# EAGLE design shield_v9 (EAGLE 6.5.0)
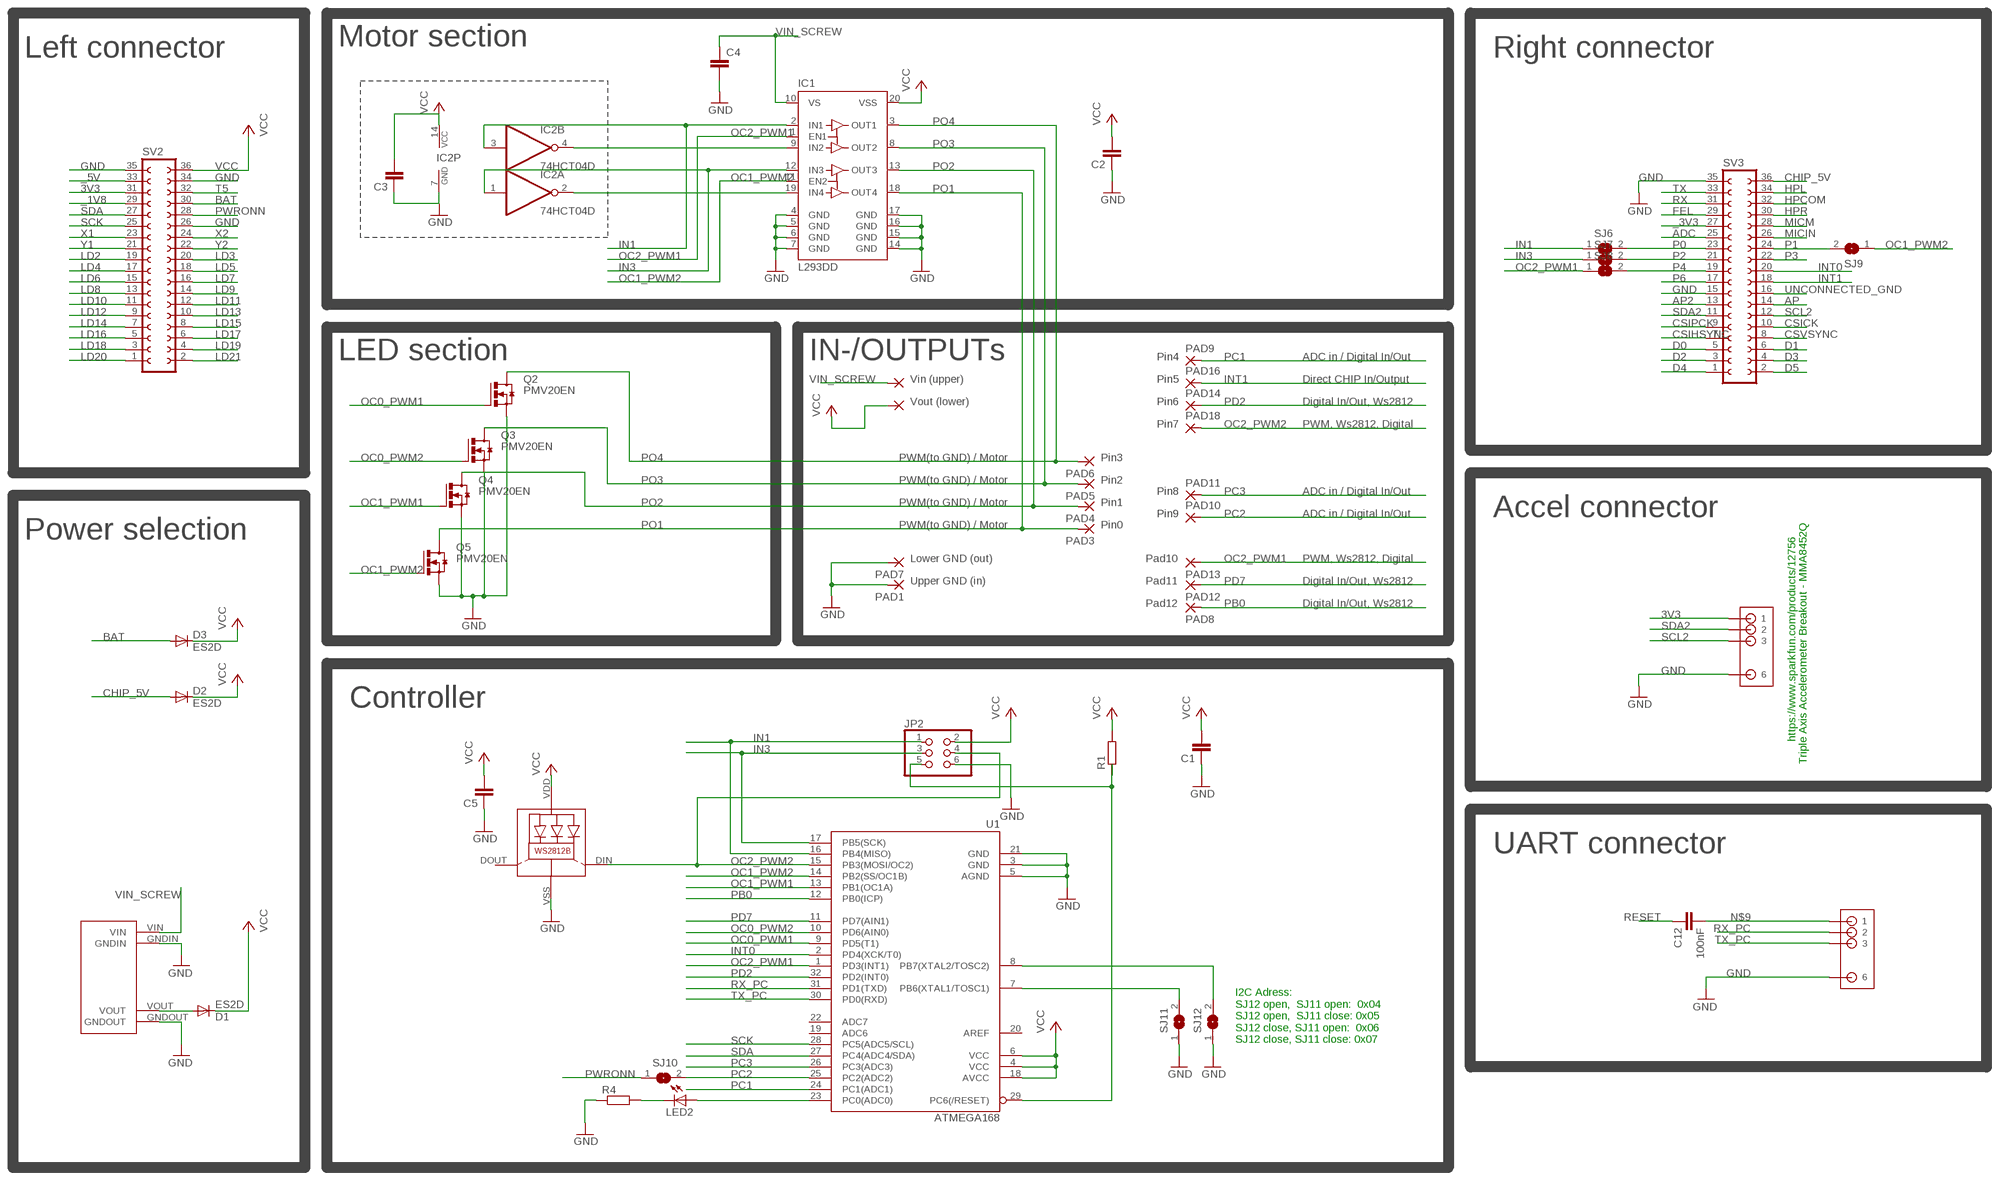
[diagram p0: schematic, sheet 1]

## Parts
C1  C-EUC0805  [C0805]
C2  C-EUC0805  [C0805]
C3  C-EUC0805  [C0805]
C4  C-EUC1210  [C1210]
C5  C-EUC0805  [C0805]
C12  100nF  C-EUC1206  [C1206]
D1  ES2D  [SMB]
D2  ES2D  [SMB]
D3  ES2D  [SMB]
IC1  L293DD  [SO20]
IC2  74HCT04D  [SO14]
JP2  PINHD-2X3  [2X03]
LED1  WS2812B  [WS2812B]
LED2  LEDCHIP-LED0805  [CHIP-LED0805]
PAD1  3,17/1,3  [3,17/1,3]
PAD2  3,17/1,3  [3,17/1,3]
PAD3  3,17/1,3  [3,17/1,3]
PAD4  3,17/1,3  [3,17/1,3]
PAD5  3,17/1,3  [3,17/1,3]
PAD6  3,17/1,3  [3,17/1,3]
PAD7  3,17/1,3  [3,17/1,3]
PAD8  WIREPADSMD1,27-254  [SMD1,27-2,54]
PAD9  3,17/1,3  [3,17/1,3]
PAD10  3,17/1,3  [3,17/1,3]
PAD11  3,17/1,3  [3,17/1,3]
PAD12  SMD2  [SMD1,27-2,54]
PAD13  SMD2  [SMD1,27-2,54]
PAD14  3,17/1,3  [3,17/1,3]
PAD16  3,17/1,3  [3,17/1,3]
PAD17  3,17/1,3  [3,17/1,3]
PAD18  3,17/1,3  [3,17/1,3]
Q2  PMV20EN  NMOSFET_SMD_223  [SOT223]
Q3  PMV20EN  NMOSFET_SMD_223  [SOT223]
Q4  PMV20EN  NMOSFET_SMD_223  [SOT223]
Q5  PMV20EN  NMOSFET_SMD_223  [SOT223]
R1  R-EU_M1206  [M1206]
R4  R-EU_M1206  [M1206]
SJ6  SJ  [SJ]
SJ7  SJ  [SJ]
SJ8  SJ  [SJ]
SJ9  SJ  [SJ]
SJ10  SJ  [SJ]
SJ11  SJ  [SJ]
SJ12  SJ  [SJ]
SV2  FE18-2  [FE18-2]
SV3  FE18-2  [FE18-2]
U1  ATMEGA168  [TQFP32-08]
U$1  MP1584EN  [MP1584EN]
U$3  6_TO_4_HEADER  [6_TO_4_HEADER]
U$4  6_TO_4_HEADER  [6_TO_4_HEADER]

## Nets
3V3: SV2.31 U$4.1
_1V8: SV2.29
_3V3: SV3.27
_5V: SV2.33
ADC: SV3.25
AP: SV3.14
AP2: SV3.13
BAT: D3.A SV2.30
CHIP_5V: D2.A SV3.36
CSICK: SV3.10
CSIHSYNC: SV3.7
CSIPCK: SV3.9
CSVSYNC: SV3.8
D0: SV3.5
D1: SV3.6
D2: SV3.3
D3: SV3.4
D4: SV3.1
D5: SV3.2
FEL: SV3.29
GND: C1.1 C2.1 C3.1 C4.2 C5.1 IC1.4(GND) IC1.5(GND) IC1.6(GND) IC1.7(GND) IC1.14(GND) IC1.15(GND) IC1.16(GND) IC1.17(GND) IC2.7(P:GND) JP2.6 LED1.VSS(GND) PAD1.1(P) PAD7.1(P) Q2.3(S) Q3.3(S) Q4.3(S) Q5.3(S) R4.1 SJ11.1 SJ12.1 SV2.26 SV2.34 SV2.35 SV3.15 SV3.35 U1.3(GND) U1.5(AGND) U1.21(GND) U$1.GNDIN U$1.GNDOUT U$3.6 U$4.6
HPCOM: SV3.32
HPL: SV3.34
HPR: SV3.30
IN1: IC1.2(IN1) IC2.3(B:I) JP2.1 SJ6.1 U1.16(PB4(MISO))
IN3: IC1.12(IN3) IC2.1(A:I) JP2.3 SJ7.1 U1.17(PB5(SCK))
INT0: SV3.20 U1.2(PD4(XCK/T0))
INT1: PAD16.1(P) SV3.18
LD2: SV2.19
LD3: SV2.20
LD4: SV2.17
LD5: SV2.18
LD6: SV2.15
LD7: SV2.16
LD8: SV2.13
LD9: SV2.14
LD10: SV2.11
LD11: SV2.12
LD12: SV2.9
LD13: SV2.10
LD14: SV2.7
LD15: SV2.8
LD16: SV2.5
LD17: SV2.6
LD18: SV2.3
LD19: SV2.4
LD20: SV2.1
LD21: SV2.2
MICIN: SV3.26
MICM: SV3.28
N$1: IC1.19(IN4) IC2.2(A:O)
N$2: SJ11.2 U1.7(PB6(XTAL1/TOSC1))
N$3: SJ12.2 U1.8(PB7(XTAL2/TOSC2))
N$7: D1.A U$1.VOUT
N$9: C12.2 U$3.1
N$11: IC1.9(IN2) IC2.4(B:O)
N$23: LED2.C R4.2
N$26: LED2.A U1.23(PC0(ADC0))
OC0_PWM1: Q2.1(G) U1.9(PD5(T1))
OC0_PWM2: Q3.1(G) U1.10(PD6(AIN0))
OC1_PWM1: Q4.1(G) U1.13(PB1(OC1A))
OC1_PWM2: IC1.11(EN2) Q5.1(G) SJ9.1 U1.14(PB2(SS/OC1B))
OC2_PWM1: IC1.1(EN1) PAD13.1(P) SJ8.1 U1.1(PD3(INT1))
OC2_PWM2: JP2.4 LED1.DIN(DI) PAD18.1(P) U1.15(PB3(MOSI/OC2))
P0: SJ6.2 SV3.23
P1: SJ9.2 SV3.24
P2: SJ7.2 SV3.21
P3: SV3.22
P4: SJ8.2 SV3.19
P6: SV3.17
PB0: PAD8.1(P) U1.12(PB0(ICP))
PC1: PAD9.1(P) U1.24(PC1(ADC1))
PC2: PAD10.1(P) SJ10.2 U1.25(PC2(ADC2))
PC3: PAD11.1(P) U1.26(PC3(ADC3))
PD2: PAD14.1(P) U1.32(PD2(INT0))
PD7: PAD12.1(P) U1.11(PD7(AIN1))
PO1: IC1.18(OUT4) PAD3.1(P) Q5.2(D) Q5.4(D)
PO2: IC1.13(OUT3) PAD4.1(P) Q4.2(D) Q4.4(D)
PO3: IC1.8(OUT2) PAD5.1(P) Q3.2(D) Q3.4(D)
PO4: IC1.3(OUT1) PAD6.1(P) Q2.2(D) Q2.4(D)
PWRONN: SJ10.1 SV2.28
RESET: C12.1 JP2.5 R1.1 U1.29(PC6(/RESET))
RX: SV3.31
RX_PC: U1.31(PD1(TXD)) U$3.2
SCK: SV2.25 U1.28(PC5(ADC5/SCL))
SCL2: SV3.12 U$4.3
SDA: SV2.27 U1.27(PC4(ADC4/SDA))
SDA2: SV3.11 U$4.2
T5: SV2.32
TX: SV3.33
TX_PC: U1.30(PD0(RXD)) U$3.3
UNCONNECTED_GND: SV3.16
VCC: C1.2 C2.2 C3.2 C5.2 D1.C D2.C D3.C IC1.20(VSS) IC2.14(P:VCC) JP2.2 LED1.VDD PAD17.1(P) R1.2 SV2.36 U1.4(VCC) U1.6(VCC) U1.18(AVCC)
VIN_SCREW: C4.1 IC1.10(VS) PAD2.1(P) U$1.VIN
X1: SV2.23
X2: SV2.24
Y1: SV2.21
Y2: SV2.22
Unconnected: IC2.5(C:I) IC2.6(C:O) IC2.8(D:O) IC2.9(D:I) IC2.10(E:O) IC2.11(E:I) IC2.12(F:O) IC2.13(F:I) LED1.DOUT(DO) U1.19(ADC6) U1.20(AREF) U1.22(ADC7)

## Notes on the sheet
- Motor section
- Left connector | Right connector
- LED section | IN-/OUTPUTs | Pin4 | ADC in / Digital In/Out
- Vin (upper) | Pin5 | Direct CHIP In/Output
- Vout (lower) | Pin6 | Digital In/Out, Ws2812
- Pin7 | PWM, Ws2812, Digital
- PWM(to GND) / Motor | Pin3
- PWM(to GND) / Motor | Pin2
- Pin8 | ADC in / Digital In/Out
- PWM(to GND) / Motor | Pin1
- Pin9 | ADC in / Digital In/Out | Accel connector
- PWM(to GND) / Motor | Pin0
- Power selection
- Lower GND (out) | Pad10 | PWM, Ws2812, Digital
- Upper GND (in) | Pad11 | Digital In/Out, Ws2812
- Pad12 | Digital In/Out, Ws2812
- Controller
- https://www.sparkfun.com/products/12756
- Triple Axis Accelerometer Breakout - MMA8452Q
- UART connector
- I2C Adress: 
  SJ12 open,  SJ11 open:  0x04
  SJ12 open,  SJ11 close: 0x05
  SJ12 close, SJ11 open:  0x06
  SJ12 close, SJ11 close: 0x07

## Library data of the parts
C1-C5 C12 = rcl:C-EU: CAPACITOR, European symbol
D1-D3 = diode:ES2D: DIODE super fast rectifier, 2 A
IC1 = st-microelectronics:L293DD: PUSH-PULL FOUR CHANNEL DRIVER WITH DIODES Source: http://www.st.com/stonline/books/pdf/docs/1330.pdf; OC_FARNELL: unknown
IC2 = 74xx-eu:74*04: Hex INVERTER
JP2 = pinhead:PINHD-2X3: PIN HEADER
LED1 = WS2812B:WS2812B: Features and Benefits  * Intelligent reverse connect protection, the power supply reverse connection does not damage the IC. * The control circuit and the LED share the only power source. Control circuit and RGB chip are integrated in a package of 5050 components, form a complete control of pixel point.  * Built-in signal reshaping circuit, after wave reshaping to the next driver, ensure wave-form distortion not accumulate.  * Built-in electric reset circuit and power lost reset circuit.  * Each pixel of the three primary color can achieve 256 brightness display, completed 16777216 color full color display, and scan frequency not less than 400Hz/s.  * Cascading port transmission signal by single line.  * Any two point the distance more than 5m transmission signal without any increase circuit.  * When the refresh rate is 30fps, cascade number are not less than1024 points.  * Send data at speeds of 800Kbps.  *The color of the light were highly consistent, cost-effective. Applications  Full-color module, Full color soft lights a lamp strip. LED decorative lighting, Indoor/outdoor LED video irregular screen. General description WS2812B is a intelligent control LED light source that the control circuit and RGB chip are integrated in a package of 5050 components. It internal include intelligent digital port data latch and signal reshaping amplification drive circuit. Also include a precision internal oscillator and a 12V voltage programmable constant curre-nt control part, effectively ensuring the pixel point light color height consistent. The data transfer protocol use single NZR communication mode. After the pixel power-on reset, the DIN port receive data from controller, the first pixel collect initial 24bit data then sent to the internal data latch, the other data which reshaping by the internal signal reshaping amplification circuit sent to the next cascade pixel through the DO port. After transmission for each pixel,the signal to reduce 24bit. pixel adopt auto reshaping transmit technology, making the pixel cascade number is not limited the signal transmission, only depend on the speed of signal transmission. LED with low driving voltage, environmental protection and energy saving, high brightness, scattering angle is large, good consistency, low power, long life and other advantages. The control chip integrated in LED above becoming more simple circuit, small volume, convenient installation. Absolute Maximum Ratings Power supply voltage: VDD +3.5V..+5.3V Input voltage: VI -0.5V..VDD+0.5V based on WS2812 from https://github.com/adafruit/Adafruit-Eagle-Library
LED2 = led:LED: LED OSRAM: - CHIPLED LG R971, LG N971, LY N971, LG Q971, LY Q971, LO R971, LY R971 LH N974, LH R974 LS Q976, LO Q976, LY Q976 LO Q996 - Hyper CHIPLED LW Q18S LB Q993, LB Q99A, LB R99A - SideLED LS A670, LO A670, LY A670, LG A670, LP A670 LB A673, LV A673, LT A673, LW A673 LH A674 LY A675 LS A676, LA A676, LO A676, LY A676, LW A676 LS A679, LY A679, LG A679 - Hyper Micro SIDELED® LS Y876, LA Y876, LO Y876, LY Y876 LT Y87S - SmartLED LW L88C, LW L88S LB L89C, LB L89S, LG L890 LS L89K, LO L89K, LY L89K LS L896, LA L896, LO L896, LY L896 - TOPLED LS T670, LO T670, LY T670, LG T670, LP T670 LSG T670, LSP T670, LSY T670, LOP T670, LYG T670 LG T671, LOG T671, LSG T671 LB T673, LV T673, LT T673, LW T673 LH T674 LS T676, LA T676, LO T676, LY T676, LB T676, LH T676, LSB T676, LW T676 LB T67C, LV T67C, LT T67C, LS T67K, LO T67K, LY T67K, LW E67C LS E67B, LA E67B, LO E67B, LY E67B, LB E67C, LV E67C, LT E67C LW T67C LS T679, LY T679, LG T679 LS T770, LO T770, LY T770, LG T770, LP T770 LB T773, LV T773, LT T773, LW T773 LH T774 LS E675, LA E675, LY E675, LS T675 LS T776, LA T776, LO T776, LY T776, LB T776 LHGB T686 LT T68C, LB T68C - Hyper Mini TOPLED® LB M676 - Mini TOPLED Santana® LG M470 LS M47K, LO M47K, LY M47K Source: http://www.osram.convergy.de LUXEON: - LUMILED® LXK2-PW12-R00, LXK2-PW12-S00, LXK2-PW14-U00, LXK2-PW14-V00 LXK2-PM12-R00, LXK2-PM12-S00, LXK2-PM14-U00 LXK2-PE12-Q00, LXK2-PE12-R00, LXK2-PE12-S00, LXK2-PE14-T00, LXK2-PE14-U00 LXK2-PB12-K00, LXK2-PB12-L00, LXK2-PB12-M00, LXK2-PB14-N00, LXK2-PB14-P00, LXK2-PB14-Q00 LXK2-PR12-L00, LXK2-PR12-M00, LXK2-PR14-Q00, LXK2-PR14-R00 LXK2-PD12-Q00, LXK2-PD12-R00, LXK2-PD12-S00 LXK2-PH12-R00, LXK2-PH12-S00 LXK2-PL12-P00, LXK2-PL12-Q00, LXK2-PL12-R00 Source: www.luxeon.com KINGBRIGHT: KA-3528ASYC Source: www.kingbright.com
PAD1-PAD7 PAD9-PAD11 PAD14 PAD16-PAD18 = wirepad:3,17/1,3: THROUGH-HOLE PAD
PAD8 = wirepad:WIREPAD: Wire PAD connect wire on PCB
PAD12 PAD13 = wirepad:SMD2: SMD PAD
Q2-Q5 = transistor-power:NMOSFET_SMD_223
R1 R4 = rcl:R-EU_: RESISTOR, European symbol
SJ6-SJ12 = jumper:SJ: SMD solder JUMPER
SV2 SV3 = con-lsta:FE18-2: FEMALE HEADER; OC_FARNELL: unknown; OC_NEWARK: unknown
U1 = SparkFun-DigitalIC:ATMEGA168: Atmel 32-pin 8-bit micro, 16k flash.
U$1 = power_supply:MP1584EN
U$3 U$4 = power_supply:6_TO_4_HEADER

## Board
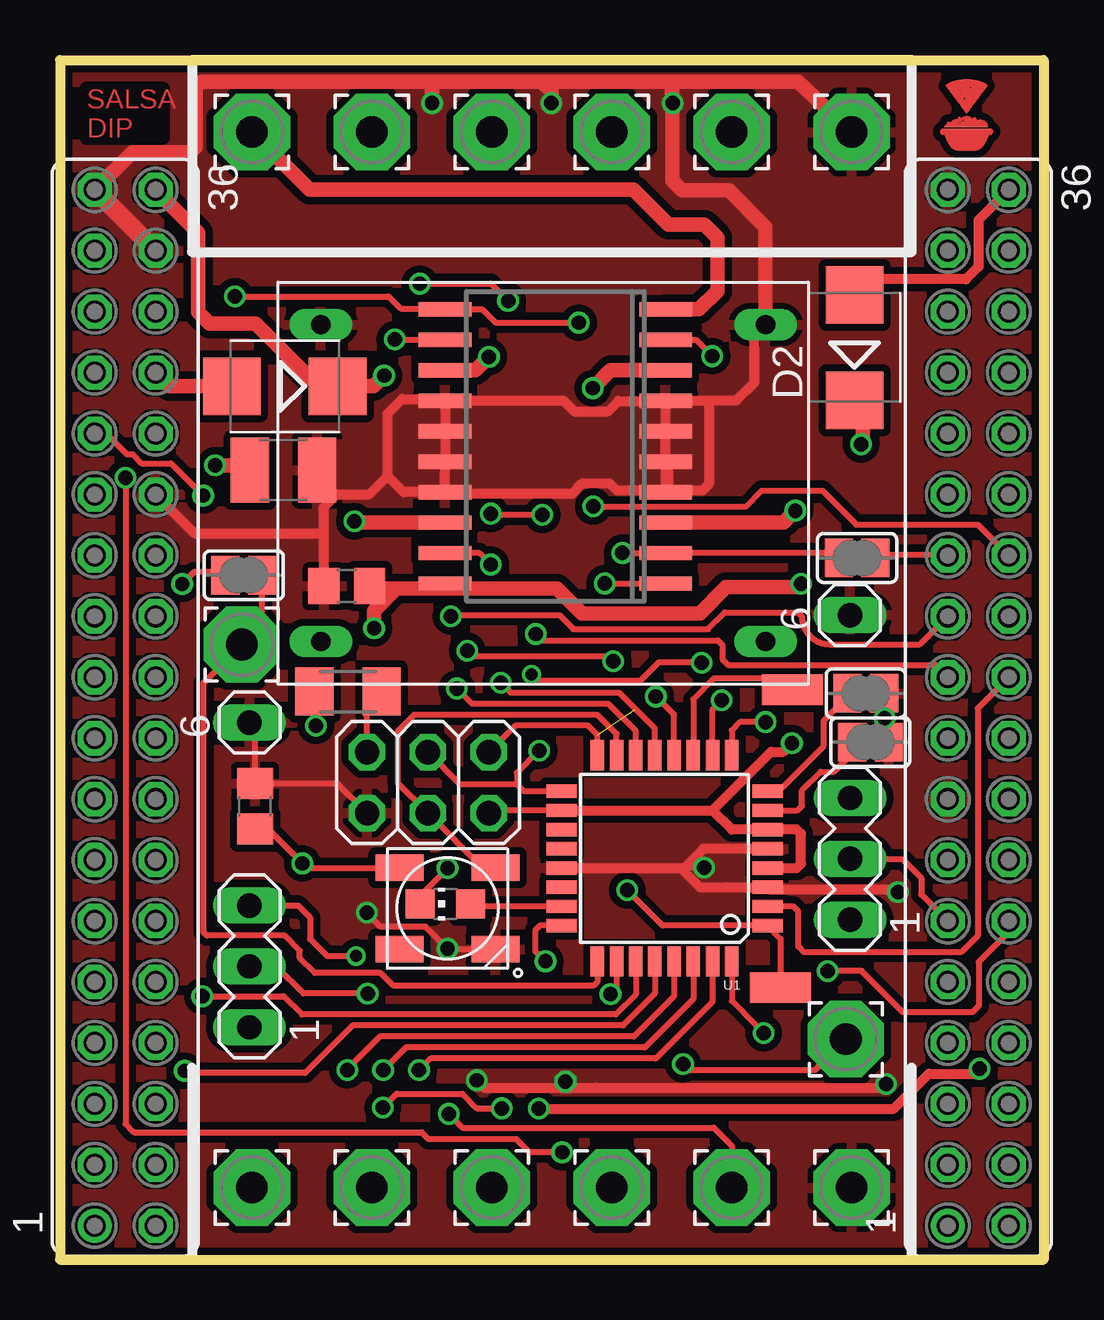
[diagram p1: board, top side]
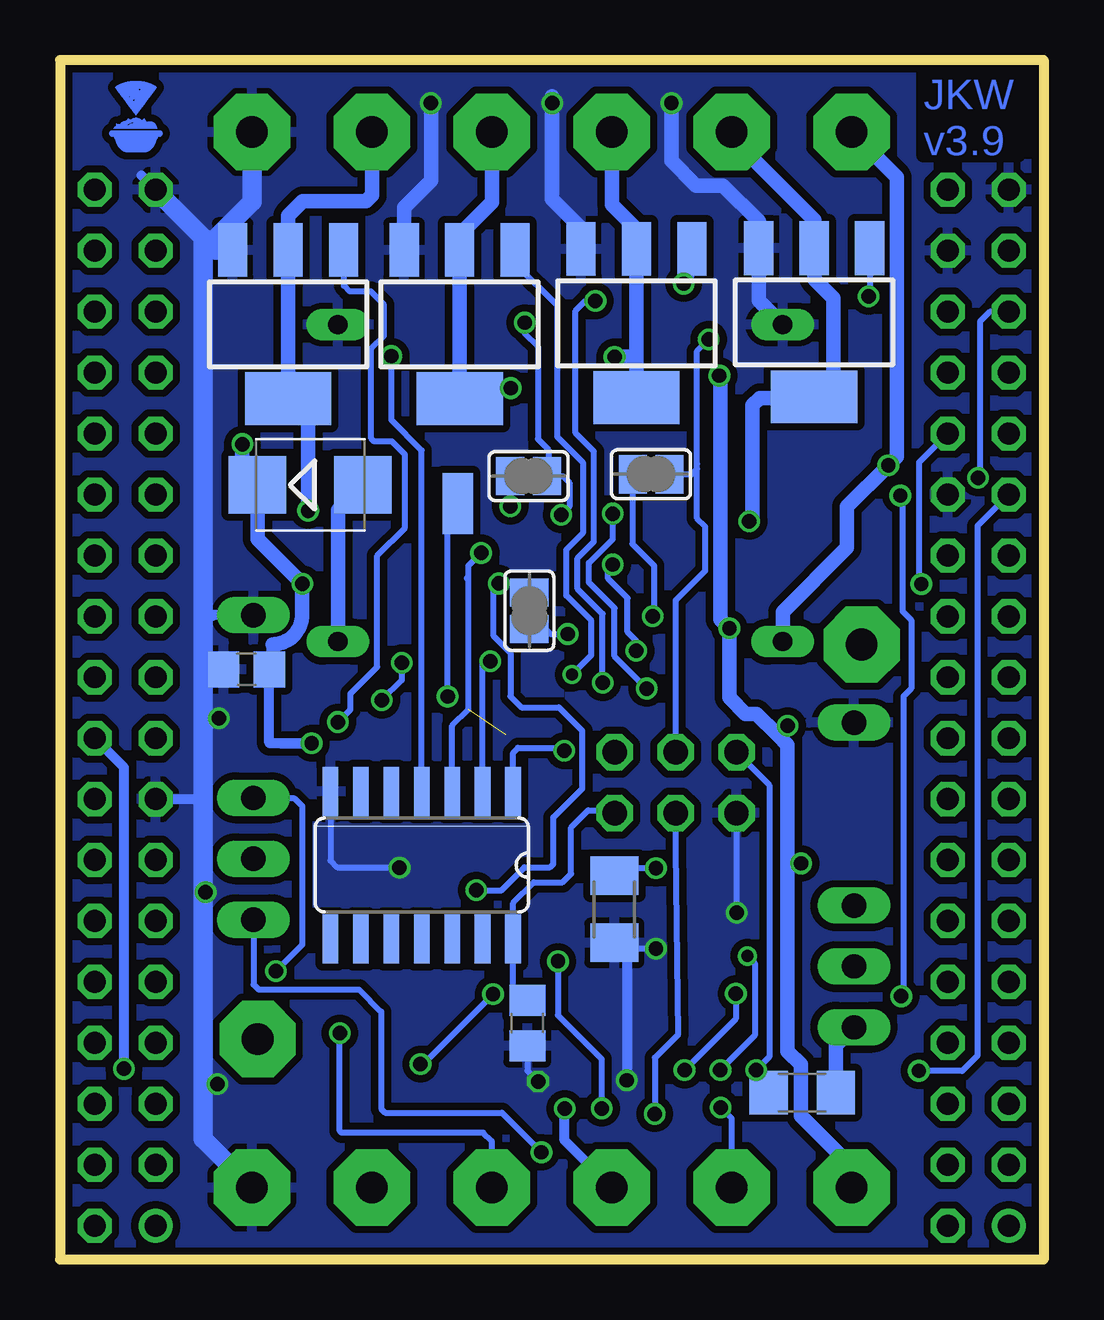
[diagram p2: board, bottom side, seen from below]

Size 41 x 50 mm. Coordinates in mm from the lower left corner, seen from the top.
Outline: 0,50 41,50 41,0 0,0 0,50
Copper layers (1*16): Top 0.035mm / dielectric 1.5mm / Bottom 0.035mm
Design rules "SeeedStudio_2layer_DRU_no_angle_20140221": minimum track width 6mil, minimum drill 12mil, track to track 6mil, track to pad 6mil, pad to pad 6mil, via to via 6mil, smd to smd 0mil, copper to edge 10mil, drill to drill 10mil, minimum pad ring 10mil, minimum via ring 6mil, stop-mask expansion 2mil, vias tented up to drill 100mil, thermal gap 10mil

### Footprints (pad centres in the part's own frame; a part is rotated, then mirrored left to right if it is on the bottom)
C0805 = smd 1.3 x 1.5: 1 -0.95,0; 2 0.95,0
C1210 = smd 1.6 x 2.7: 1 -1.4,0; 2 1.4,0
C1206 = smd 1.6 x 1.8: 1 -1.4,0; 2 1.4,0
SMB = smd 2.4 x 2.4: A 2.2,0; C -2.2,0
SO20 = smd 0.6 x 2.2: 1 -5.715,-4.6; 2 -4.445,-4.6; 3 -3.175,-4.6; 4 -1.905,-4.6; 5 -0.635,-4.6; 6 0.635,-4.6; 7 1.905,-4.6; 8 3.175,-4.6; 9 4.445,-4.6; 10 5.715,-4.6; 11 5.715,4.6; 12 4.445,4.6; 13 3.175,4.6; 14 1.905,4.6; 15 0.635,4.6; 16 -0.635,4.6; 17 -1.905,4.6; 18 -3.175,4.6; 19 -4.445,4.6; 20 -5.715,4.6
SO14 = smd 0.66 x 2.032: 1 -3.81,-3.073; 2 -2.54,-3.073; 3 -1.27,-3.073; 4 0,-3.073; 5 1.27,-3.073; 6 2.54,-3.073; 7 3.81,-3.073; 8 3.81,3.073; 9 2.54,3.073; 10 1.27,3.073; 11 0,3.073; 12 -1.27,3.073; 13 -2.54,3.073; 14 -3.81,3.073
2X03 = drill 1.016 octagon: 1 -2.54,-1.27; 2 -2.54,1.27; 3 0,-1.27; 4 0,1.27; 5 2.54,-1.27; 6 2.54,1.27
WS2812B = smd 2 x 1.1: DIN 2,1.7; DOUT -2,-1.7; VDD -2,1.7; VSS 2,-1.7
CHIP-LED0805 = smd 1.2 x 1.2: A 0,-1.05; C 0,1.05
3,17/1,3 = drill 1.321 pad 3.175 octagon: 1 0,0
SMD1,27-2,54 = smd 1.27 x 2.54: 1 0,0
SOT223 = smd 1.219 x 2.235: 1 -2.311,-3.099; 2 0,-3.099; 3 2.311,-3.099 | smd 3.6 x 2.2: 4 0,3.099
M1206 = smd 1.6 x 2: 1 -1.4,0; 2 1.4,0
SJ = smd 1.168 x 1.6: 1 -0.762,0; 2 0.762,0
FE18-2 = drill 0.914: 1 -21.59,1.27 | drill 0.914 octagon: 2 -21.59,-1.27; 3 -19.05,1.27; 4 -19.05,-1.27; 5 -16.51,1.27; 6 -16.51,-1.27; 7 -13.97,1.27; 8 -13.97,-1.27; 9 -11.43,1.27; 10 -11.43,-1.27; 11 -8.89,1.27; 12 -8.89,-1.27; 13 -6.35,1.27; 14 -6.35,-1.27; 15 -3.81,1.27; 16 -3.81,-1.27; 17 -1.27,1.27; 18 -1.27,-1.27; 19 1.27,1.27; 20 1.27,-1.27; 21 3.81,1.27; 22 3.81,-1.27; 23 6.35,1.27; 24 6.35,-1.27; 25 8.89,1.27; 26 8.89,-1.27; 27 11.43,1.27; 28 11.43,-1.27; 29 13.97,1.27; 30 13.97,-1.27; 31 16.51,1.27; 32 16.51,-1.27; 33 19.05,1.27; 34 19.05,-1.27; 35 21.59,1.27; 36 21.59,-1.27
TQFP32-08 = smd 1.27 x 0.559: 1 -4.293,2.8; 2 -4.293,2; 3 -4.293,1.2; 4 -4.293,0.4; 5 -4.293,-0.4; 6 -4.293,-1.2; 7 -4.293,-2; 8 -4.293,-2.8; 17 4.293,-2.8; 18 4.293,-2; 19 4.293,-1.2; 20 4.293,-0.4; 21 4.293,0.4; 22 4.293,1.2; 23 4.293,2; 24 4.293,2.8 | smd 0.559 x 1.27: 9 -2.8,-4.293; 10 -2,-4.293; 11 -1.2,-4.293; 12 -0.4,-4.293; 13 0.4,-4.293; 14 1.2,-4.293; 15 2,-4.293; 16 2.8,-4.293; 25 2.8,4.293; 26 2,4.293; 27 1.2,4.293; 28 0.4,4.293; 29 -0.4,4.293; 30 -1.2,4.293; 31 -2,4.293; 32 -2.8,4.293
MP1584EN = drill 0.8 long: GNDIN 1.778,14.986; GNDOUT 20.32,14.986; VIN 1.778,1.778; VOUT 20.32,1.778
6_TO_4_HEADER = drill 1.016 long: 1 0,-6.35; 2 0,-3.81; 3 0,-1.27; 6 0,6.35

### Placement (x,y rotation side)
C1  33.22,24.6 0 bottom
C2  11.95,28.07 0 top
C3  21.52,9.85 90 bottom
C4  9.32,32.91 0 top
C5  8.13,18.9 270 top
C12  10.06,6.96 0 bottom
D1  30.57,32.28 0 bottom
D2  33.12,38.01 90 top
D3  9.37,36.4 180 top
IC1  20.65,33.89 90 top
IC2  25.92,16.44 180 bottom
JP2  15.34,19.88 180 top
LED1  16.15,14.63 0 top
LED2  16.06,14.82 90 top
PAD1  33,47 0 top
PAD2  8,47 0 top
PAD3  13,47 0 top
PAD4  18,47 0 top
PAD5  23,47 0 top
PAD6  28,47 0 top
PAD7  33,3 0 top
PAD8  24.42,31.5 180 bottom
PAD9  13,3 0 top
PAD10  7.58,25.63 0 top
PAD11  32.76,9.18 0 top
PAD12  30.52,23.76 270 top
PAD13  30.04,11.33 90 top
PAD14  23,3 0 top
PAD16  18,3 0 top
PAD17  8,3 0 top
PAD18  28,3 0 top
Q2  31.49,38.98 180 bottom
Q3  24.34,38.98 180 bottom
Q4  16.97,39.02 180 bottom
Q5  9.56,39.06 180 bottom
R1  12.01,23.67 180 top
R4  17.89,14.6 90 bottom
SJ6  33.23,29.24 0 top
SJ7  16.36,32.74 180 bottom
SJ8  21.43,27.05 270 bottom
SJ9  21.47,32.66 180 bottom
SJ10  7.66,28.52 0 top
SJ11  33.78,21.56 180 top
SJ12  33.59,23.6 180 top
SV2  2.72,23 90 top
SV3  38.28,23 90 top
U1  25.2,16.72 180 top
U$1  9.09,23.98 0 top
U$2  LOGO  [LOGO]  36.54,46.02 0 top
U$3  7.9,16.03 0 top
U$4  32.93,20.51 0 top
U$5  LOGO  [LOGO]  39.09,46.1 0 bottom

### Tracks (layer width: path | path; a pad name or v marks a point on that pad's centre or on a via)
3V3  (via drill 0.6)
  Top 0.254: v2.73,32.59 2.73,5.65 3.07,5.31 15.07,5.31 15.37,5.02 19.02,5.02 19.57,4.47 v20.93,4.47
  Bottom 0.254: U$4.1 32.93,11.47 32.72,11.25 28.54,11.25 27.61,10.32 27.61,6.29 27.45,6.12 22.58,6.12 v20.93,4.47 | SV2.31 2.23,39.51 2.65,39.09 2.65,32.66 v2.73,32.59
BAT
  Top 0.61: SV2.30 4.56,36.4 D3.A
CHIP_5V
  Top 0.406: SV3.36 38.29,43.33 38.29,41.38 37.77,40.86 34.13,40.86 D2.A
GND  (via drill 0.6)
  Top 0.254: 34.29,7.16 v34.44,7.32 | LED1.VSS 16.48,12.93 v16.15,12.95 15.24,13.87 13.37,13.87 v12.79,14.45 | 22.38,7.18 22.36,7.16 | U$3.6 8.13,22.15 C5.1 11.56,19.85 JP2.6 | v26.85,16.33 26.18,16.33 26.11,16.4 | 34.35,21.75 SJ11.1 34.38,21.73 v34.38,22.57 34.35,22.59 SJ12.1
  Top 0.406: U1.21 25.87,16.32 25.95,16.24 | 29.45,17.08 U1.5 26.82,17.12 26.11,16.4 25.95,16.24 | 27.77,15.52 U1.3 | v17.37,7.47 17.68,7.16 22.36,7.16 34.29,7.16 | 25.95,16.24 26.67,15.52 U1.3 | IC1.7 23.28,35.79 22.84,35.34 21.45,35.34 21,35.8 IC1.14 IC1.15 | IC1.7 27.03,35.8 27.05,35.81 | 27.05,35.81 27.05,32.32 26.78,32.05 25.32,32.05 | 25.32,32.05 IC1.4 | 25.32,32.05 23.22,32.05 22.94,32.33 21.77,32.33 21.35,31.91 16.12,31.91 IC1.17 | IC1.17 14.33,31.99 13.65,32.66 | 13.65,32.66 13.65,35.26 14.26,35.87 16,35.87 16.03,35.84 | 27.05,35.81 28.21,35.81 28.94,36.55 28.94,38.49 U$1.GNDOUT | IC1.17 IC1.16 | IC1.15 16.05,33.28 16.07,33.26 16.07,34.51 IC1.15 | IC1.7 25.24,32.09 25.38,31.95 25.38,33.13 IC1.5 IC1.6 | 13.65,32.66 12.88,31.89 11.53,31.89 11,31.36 11,30.26 | C2.1 11,30.26 | SV2.26 5.62,30.26 11,30.26 | U1.3 29.58,15.43 34.81,15.43 v34.93,15.31 | SJ11.1 34.51,21.6
  Top 0.61: 15.51,49.1 20.08,49.1 | 20.08,49.1 25.51,49.1 | 25.51,49.1 30.77,49.1 PAD1.1 | 25.51,49.1 25.51,48.52 v25.54,48.2 25.54,44.96 25.93,44.56 27.89,44.56 29.41,43.04 U$1.GNDOUT | v15.51,48.2 15.51,49.1 | v20.48,48.2 20.48,48.7 20.08,49.1 | 15.51,49.1 5.92,49.1 5.66,48.84 5.66,46.35 5.47,46.16 3.02,46.16 SV2.35
  Top 0.813: SV2.35 SV2.34
  Bottom 0.254: 17.37,12.68 R4.1 17.65,12.95 v16.15,12.95 | C3.1 21.52,7.87 v21.07,7.42 | JP2.6 12.8,14.46 v12.79,14.45 | 34.63,26.84 35.04,27.24 | IC2.7 29.73,16.63 29.44,16.34 26.86,16.34 v26.85,16.33 | C1.1 34.26,24.69 35.04,24.69 | 32.63,47.37 PAD1.1
  Bottom 0.406: SV3.15 35.11,19.19 35.04,19.12 | 35.05,15.41 35.04,15.42 | 35.04,15.2 v34.93,15.31 34.93,15.71 35.04,15.82 | 35,21.45 35.04,21.41 | 34.92,21.43 34.9,21.45 35.04,21.59 35.04,21.61 | 34.89,26.55 35.04,26.4 | 17.37,12.68 v17.37,7.47 | v34.44,7.32 35.04,7.32 | 37.61,45.19 SV3.35 | 34.84,38.95 35.04,38.75 | v34.38,22.57 34.56,22.49 35.04,22.02 | U$4.6 34.61,26.86 34.63,26.84
  Bottom 0.61: Q3.3 26.65,43.85 25.54,44.96 v25.54,48.2 | v20.48,48.2 20.49,48.48 20.49,44.2 19.28,42.99 Q4.3 | v15.51,48.2 15.51,45.8 14.48,44.77 13.36,44.77 11.87,43.28 Q5.3 11.87,39.96 U$1.GNDIN
  Bottom 0.813: 35.04,42.6 35.04,38.75 35.04,27.24 35.04,26.4 35.04,24.69 35.04,22.02 35.04,21.61 35.04,21.41 35.04,19.12 35.04,15.82 35.04,15.42 35.04,15.2 35.04,7.32 35.04,5.04 PAD7.1 | Q2.3 34.52,42.08 34.76,42.33 | 34.76,42.33 35.04,42.6 | PAD1.1 33,44.09 34.76,42.33 | SV3.35 37.01,44.57 35.04,42.6
  pour Top (isolate 0.305, rank 2): -0.07,0.25 40.88,0.25 41.01,10.57 41.01,50.01 0,50.01 0,10.47
  pour Bottom (isolate 0.305): 0,50 41.05,50 41.05,0.25 0.02,0.25 0.02,49.92
  pour Top (isolate 0.305, no thermals): 12.24,34.04 14.05,35.84 20.97,35.9 21.42,35.45 22.83,35.45 23.2,35.81 28.13,35.81 28.24,35.7 28.24,32.35 27.85,31.95 23.33,31.95 23.05,32.23 21.77,32.23 21.4,31.86 11.16,31.85 10.36,32.65 10.26,34.09
IN1  (via drill 0.6)  (1 unrouted)
  Top 0.254: JP2.1 18.98,22.25 22.02,22.25 22.4,21.87 U1.16 | v23.44,29.45 IC1.2 32.26,29.45 SJ6.1
  Bottom 0.254: IC2.3 24.65,22.25 23.98,22.92 23.98,28.46 | 23.98,28.46 23.98,28.92 v23.44,29.45 | 24.04,28.4 23.98,28.46
IN3  (via drill 0.6)
  Top 0.254: U1.17 19.34,19.52 19.05,19.81 | 19.05,19.81 16.68,19.81 JP2.3 | v19.98,21.21 19.05,20.28 19.05,19.81 | v13.96,38.35 16.03,38.35 IC1.12
  Bottom 0.254: JP2.3 15.34,27.47 14.1,28.71 14.1,30.54 14.44,30.89 14.44,32.96 | IC2.1 22.11,21.12 21.91,21.32 20.09,21.32 v19.98,21.21 | 14.22,38.09 v13.96,38.35 14.44,37.87 14.44,33.16 14.44,32.96 | SJ7.1 14.66,32.73 14.44,32.96
INT0
  Top 0.254: SV3.20 38.25,22.97 38.25,13.49 37.59,12.83 30.99,12.83 30.77,13.04 30.77,14.52 30.57,14.72 U1.2
INT1  (via drill 0.6)
  Top 0.406: v19.96,6.29 34.76,6.29 36.22,7.75 38.13,7.75 v38.33,7.95
  Bottom 0.406: PAD16.1 19.96,4.96 v19.96,6.29 | v38.33,7.95 38.33,20.51 SV3.18
N$1  (via drill 0.6)
  Top 0.254: 17.21,25.15 v16.98,25.38 17.22,25.13 22.87,25.13 v23.06,24.94 | v17.96,28.97 17.48,29.45 IC1.19
  Bottom 0.254: IC2.2 23.38,24.83 23.27,24.94 v23.06,24.94 | v16.98,25.38 16.98,25.79 17.34,26.15 17.34,27.57 18.15,28.38 18.15,28.78 v17.96,28.97
N$2
  Top 0.254: U1.7 30.75,18.72 30.94,18.91 30.94,19.56 31.71,20.33 32.27,20.33 33.03,21.09 33.03,21.78 33.03,22.12
  Top 0.406: SJ11.2 33.03,21.58 33.03,21.78
N$3
  Top 0.254: U1.8 29.95,19.52 31.84,21.41 31.84,22.47 32.83,23.46 SJ12.2
N$7
  Bottom 0.61: U$1.VOUT 29.41,31.24 D1.A
N$9
  Bottom 0.406: 7.9,9.61 U$3.1
  Bottom 0.61: C12.2 8.66,8.92 U$3.1
N$11  (via drill 0.6)
  Top 0.254: IC1.9 26.51,38.34 v27.19,37.66
  Bottom 0.254: IC2.4 25.92,33.73 27.19,35 v27.19,37.66
N$23  (via drill 0.6)
  Top 0.254: LED2.C 15.01,15.16 v16.15,16.31
  Bottom 0.254: v16.15,16.31 17.59,16.31 arc-90 R4.2
N$26
  Top 0.254: U1.23 17.21,14.72
  Top 0.406: 17.21,14.72 LED2.A
OC0_PWM1  (via drill 0.6)
  Top 0.254: v29.41,22.4 28.35,22.4 28,22.06 U1.9
  Bottom 0.254: v29.41,22.4 28.89,22.93 28.89,23.59 27.77,24.7 27.77,29.34 26.62,30.49 26.62,33.55 27.16,34.1 27.9,34.1 28.03,34.23 28.03,37.96 27.5,38.49 27.5,39.8 28.04,40.35 28.92,40.35 29.16,40.59 29.16,41.4 29.18,41.42 | 29.13,42.03 Q2.1
  Bottom 0.406: 29.18,41.42 Q2.1
OC0_PWM2  (via drill 0.5, 0.6)
  Top 0.254: U1.10 27.2,22.93 v27.58,23.32 | v19.66,24.38 19.91,24.13 24.19,24.13 24.94,24.88 v26.75,24.88
  Bottom 0.254: 22.1,42.01 Q3.1 22.03,41.51 20.27,39.75 20.27,34.29 19.2,33.22 19.2,30.28 19.89,29.59 19.89,27.67 18.85,26.63 18.85,25.2 v19.66,24.38 | v27.58,23.32 26.75,24.16 v26.75,24.88
  Bottom 0.406: Q3.1 22.06,42.05
OC1_PWM1  (via drill 0.6)
  Top 0.254: U1.13 24.8,22.14 23.32,23.62 18.8,23.62 v18.38,24.04 | v15,40.68 17.96,40.68 v18.68,39.96
  Bottom 0.254: v18.68,39.96 19.09,39.96 19.51,39.54 19.51,34.44 18.75,33.68 18.75,29.92 19.42,29.25 19.42,27.95 18.38,26.91 v18.38,24.04 | Q4.1 14.66,41.02 v15,40.68
OC1_PWM2  (via drill 0.6)
  Top 0.254: U1.14 24,22.02 22.86,23.16 17.18,23.16 v16.54,23.8 | v7.29,40.15 13.69,40.15 14.2,39.64 16.02,39.64 IC1.11 17.59,39.61 18.15,39.05 v21.63,39.05 | v20.1,31.04 18.01,31.04 v17.96,31.09
  Bottom 0.254: v16.54,23.8 17.88,25.14 17.88,27.15 18.95,28.22 18.95,29.03 17.96,30.02 v17.96,31.09 17.88,31.01 | Q5.1 7.25,40.19 v7.29,40.15 | v21.63,39.05 21.63,38.59 21.08,38.05 21.08,34.2 20.64,33.76 20.64,32.72 SJ9.1 20.03,32.66 19.76,32.38 19.76,31.38 v20.1,31.04
  Bottom 0.406: 7.25,42.99 Q5.1
OC2_PWM1  (via drill 0.6)
  Top 0.254: v22.71,28.18 IC1.1 | PAD13.1 30.04,13.37 U1.1 25.12,13.92 v23.65,15.39
  Bottom 0.254: SJ8.1 21.2,28.18 v22.71,28.18 22.92,27.96 22.92,25.98 22.23,25.29 22.23,23.47 21.77,23.01 20.21,23.01 19.23,22.04 19.23,19.63 20.43,18.43 20.43,16.48 20.57,16.34 21.64,16.34 22.59,15.39 v23.65,15.39
OC2_PWM2  (via drill 0.6)
  Top 0.254: PAD18.1 28,4.75 27.25,5.5 16.78,5.5 v16.2,6.07 | U1.15 23.2,21.91 22.4,22.71 14.77,22.71 14.08,22.02 14.08,19.87 JP2.4 17.62,16.33 LED1.DIN
  Bottom 0.254: JP2.4 15.22,9.39 16.2,8.41 16.2,6.34 v16.2,6.07
P0
  Top 0.254: SJ6.2 34.12,29.38 36.98,29.38
  Top 0.406: 36.98,29.38 SV3.23
P1  (via drill 0.6)
  Top 0.254: SV3.24 38.27,30.63 33.2,30.63 31.79,32.04 29.25,32.04 28.6,31.39 v22.23,31.39
  Bottom 0.254: v22.23,31.39 SJ9.2
P2  (via drill 0.6)
  Top 0.254: SV3.21 35.84,25.64 32.09,25.64 arc-90 30.92,26.81 30.76,26.98 27.71,26.98 27.01,26.28 21.4,26.28 20.82,26.86 16.34,26.86 v16.29,26.81
  Bottom 0.254: 17.16,32.7 17.14,32.71 | 17.14,32.71 SJ7.2 | 17.14,32.71 17.14,29.83 16.23,28.92 16.23,26.87 v16.29,26.81
P4  (via drill 0.6)
  Top 0.254: SV3.19 36.49,24.79 27.84,24.79 27.64,24.99 27.64,25.59 27.42,25.81 20.1,25.81 v19.84,26.07
  Bottom 0.254: SJ8.2 21.34,26.38 20.87,26.38 20.56,26.07 v19.84,26.07
PB0  (via drill 0.6)
  Top 0.254: U1.12 25.6,22.71 v24.84,23.47
  Bottom 0.254: v24.84,23.47 24.84,31.09 PAD8.1
PC1  (via drill 0.6)
  Top 0.254: U1.24 20.02,13.92 19.81,13.72 19.81,12.86 v20.24,12.43 | 18.38,6.34 v18.42,6.3 18.41,6.31 17.37,6.31 16.78,6.91 14.03,6.91 v13.46,6.34
  Bottom 0.254: v20.24,12.43 20.24,10.18 18.42,8.36 v18.42,6.3 | PAD9.1 13,5.88 v13.46,6.34
PC2
  Top 0.254: U1.25 22.4,11.58 22.25,11.43 13.88,11.43 13.37,11.94 10.63,11.94 9.99,12.57 9.99,12.87 9.36,13.5 6.12,13.5 5.98,13.64 5.98,24.04 PAD10.1 8.28,26.34 8.42,26.34 SJ10.2
PC3  (via drill 0.6)
  Top 0.254: 31.57,8 PAD11.1 31.46,7.89 26.23,7.89 v25.97,8.14 | U1.26 23.2,11.31 v22.95,11.06
  Bottom 0.254: v22.95,11.06 25.87,8.14 v25.97,8.14
PD2  (via drill 0.6)
  Top 0.254: U1.32 28,10.78 29.01,9.77 v29.34,9.44
  Bottom 0.254: PAD14.1 23,4.93 23.36,5.28 29.26,5.28 29.34,5.36 v29.34,9.44
PD7
  Top 0.254: U1.11 26.4,23.35 27.28,24.23 30.05,24.23 PAD12.1
PO1  (via drill 0.6)
  Top 0.61: IC1.18 12.32,30.72 arc-90 v12.27,30.77
  Bottom 0.406: 9.38,35.78 Q5.4
  Bottom 0.61: PAD3.1 13,46.77 9.56,43.33 Q5.2 9.56,40.87 8.76,40.07 8.76,36.76 Q5.4 | 9.28,35.69 Q5.4 | Q5.4 9.61,35.92 11.82,35.92 12.13,35.61 12.13,30.91 v12.27,30.77
PO2  (via drill 0.6)
  Top 0.61: IC1.13 17.32,37.07 v17.88,37.63
  Bottom 0.61: PAD4.1 18,43.97 16.97,42.94 Q4.2 16.97,37.63 | 15.76,35.92 Q4.4 16.97,37.63 | v17.88,37.63 16.97,37.63
PO3  (via drill 0.6)
  Top 0.61: IC1.8 22.96,37.07 v22.21,36.32
  Bottom 0.61: PAD5.1 23,44.07 24.34,42.73 Q3.2 Q3.4 23.9,36.32 v22.21,36.32
PO4  (via drill 0.6)
  Top 0.61: IC1.3 30.16,30.72 v30.66,31.22
  Bottom 0.61: PAD6.1 28,44.37 28.25,44.12 30.88,44.12 31.49,43.51 Q2.2 Q2.4 30.66,35.05 v30.66,31.22
PWRONN  (via drill 0.6)
  Top 0.254: SJ10.1 6.76,28.66 5.6,28.66 v5.09,28.16
  Bottom 0.254: SV2.28 5.18,33.24 5.18,28.25 v5.09,28.16
RESET  (via drill 0.6)
  Top 0.254: U1.29 25.6,10.97 23.93,9.3 13.34,9.3 11.98,7.94 v11.98,7.89 | JP2.5 12.8,23.06 R1.1
  Bottom 0.254: C12.1 10.82,6.73 v11.98,7.89 11.43,8.44 11.43,19.78 JP2.5
  Bottom 0.406: 11.96,7.92 v11.98,7.89
RX_PC  (via drill 0.6)
  Top 0.254: U1.31 27.2,10.74 24.84,8.38 15.45,8.38 v14.96,7.89 | v12.83,11.09 10.15,11.09 9.02,12.22 U$3.2
  Bottom 0.254: v12.83,11.09 12.83,10.03 v14.96,7.89
SCK  (via drill 0.6)
  Top 0.254: U1.28 24.8,11.08 23.47,9.75 12.19,9.75 10.21,7.77 5.29,7.77 v5.2,7.86
  Bottom 0.254: v5.2,7.86 3.39,7.86 2.76,8.49 2.76,30.58 SV2.25
SCL2  (via drill 0.6)
  Top 0.254: 39.55,13.65 38.3,12.4 38.3,10.57 38.04,10.31 35.14,10.31 33.41,12.04 32.02,12.04 v32,12.02
  Top 0.406: SV3.12 39.55,13.65
  Bottom 0.254: v32,12.02 30.9,13.12 30.9,18.9 31.21,19.21 32.91,19.21 U$4.3
SDA  (via drill 0.6)
  Top 0.254: U1.27 24,11.05 23.16,10.21 10.08,10.21 9.32,10.97 v5.93,10.97 | v5.97,31.84 4.63,33.19 3.42,33.19 3.04,33.57 2.78,33.57 1.92,34.43 SV2.27
  Bottom 0.254: 5.88,11.02 v5.93,10.97 5.84,11.06 5.84,23.47 5.51,23.8 5.51,26.66 5.88,27.03 5.88,31.75 v5.97,31.84
SDA2
  Top 0.254: SV3.11 35.9,15.21 35.9,15.9 35.13,16.68 32.96,16.68 U$4.2
TX_PC  (via drill 0.5, 0.6)
  Top 0.254: U1.30 26.4,10.86 24.38,8.84 14.42,8.84 v13.47,7.89 | 12.04,12.65 v12.34,12.65 11.14,12.65 10.43,13.36 10.43,14.26 9.93,14.76 U$3.3
  Bottom 0.254: v13.47,7.89 v13.48,7.9 12.04,9.34 12.04,12.34 v12.34,12.65
VCC  (via drill 0.6)
  Top 0.254: U1.18 17.99,18.72 JP2.2 | LED1.VDD 10.29,16.33 v10.11,16.51 8.67,17.95 C5.2 | R1.2 10.61,22.31 v10.67,22.25 | v33.4,33.98 33.48,34.06
  Top 0.406: U1.18 27.2,18.72 | 27.2,18.72 29.64,21.16 30.15,21.16 v30.51,21.52 | C2.2 15.94,28.07 IC1.20 | D3.C 10.99,36.4 | U1.4 30.71,16.32 30.89,16.5 30.89,17.74 30.7,17.93 29.5,17.93 U1.6 28,17.92 27.2,18.72
  Top 0.61: 32.99,35.32 D2.C arc-90 33.48,35.46 33.48,34.06 | v13.09,26.31 13.09,27.04 14.02,27.96 15.84,27.96 | 15.84,27.96 IC1.20 | 15.84,27.96 20.73,27.96 21.75,26.94 26.67,26.94 27.76,28.03 30.76,28.03 v30.9,28.17 | v13.51,36.84 13.07,36.4 D3.C 10.77,36.4 8.17,39 6.25,39 5.75,39.5 5.75,42.81 3.99,44.58 SV2.36
  Bottom 0.254: C3.2 22.11,11.39 IC2.14 22.11,14.86 21.25,15.72 20.05,15.72 19.7,16.08 19.7,18.01 18.99,18.72 17.99,18.72 JP2.2 | v10.11,16.51 10.65,16.51 10.67,16.52 | 32.14,25.64 32.27,25.51 C1.2 | v10.67,22.25 10.72,22.25 11.09,21.88
  Bottom 0.305: 13.16,26.38 v13.09,26.31
  Bottom 0.406: 31.82,21.52 v30.51,21.52 32.25,21.52 32.27,21.54 C1.2 | 13.46,36.79 v13.51,36.84
  Bottom 0.61: v33.4,33.98 33.4,32.92 D1.C 32.77,30.04 v30.9,28.17 30.9,26.89 arc90 32.14,25.64 | PAD17.1 8,3.86 10.12,5.98 10.12,8.13 10.67,8.67 10.67,16.52 10.67,21.45 11.09,21.88 11.96,22.75 12.42,22.75 13.09,23.42 v13.09,26.31 13.46,26.68 13.46,36.79
VIN_SCREW  (via drill 0.6)
  Top 0.61: IC1.10 26.64,39.61 27.41,40.37 27.41,42.6 26.87,43.13 25.38,43.13 23.9,44.6 10.4,44.6 PAD2.1 | C4.1 7.72,33.1 v6.47,33.1
  Bottom 0.61: PAD2.1 6.11,45.11 6.11,33.47 v6.47,33.1 8.19,31.38 8.19,29.67 10.87,26.99 U$1.VIN

### Text on the board
Top: SALSA / DIP
Bottom: JKW / v3.9
tStop: SALSA / DIP | SALSA DIP v3.9 | 9 | 10 | 11 | 8: A_IN | 5V | 4:ADC | 5:C_IN | 6:A_IN | 7:NEO | GND
bStop: 5V | 0:PWM | 1:PWM | 2:PWM | 3:PWM | GND | JKW / v3.9 | 5V | 4:ADC | 5:C_IN | 7:NEO | GND | 6:A_IN